# EAGLE board snc98_Display_15x7-Seg_1-digit_SC52 (EAGLE 6.6.0)
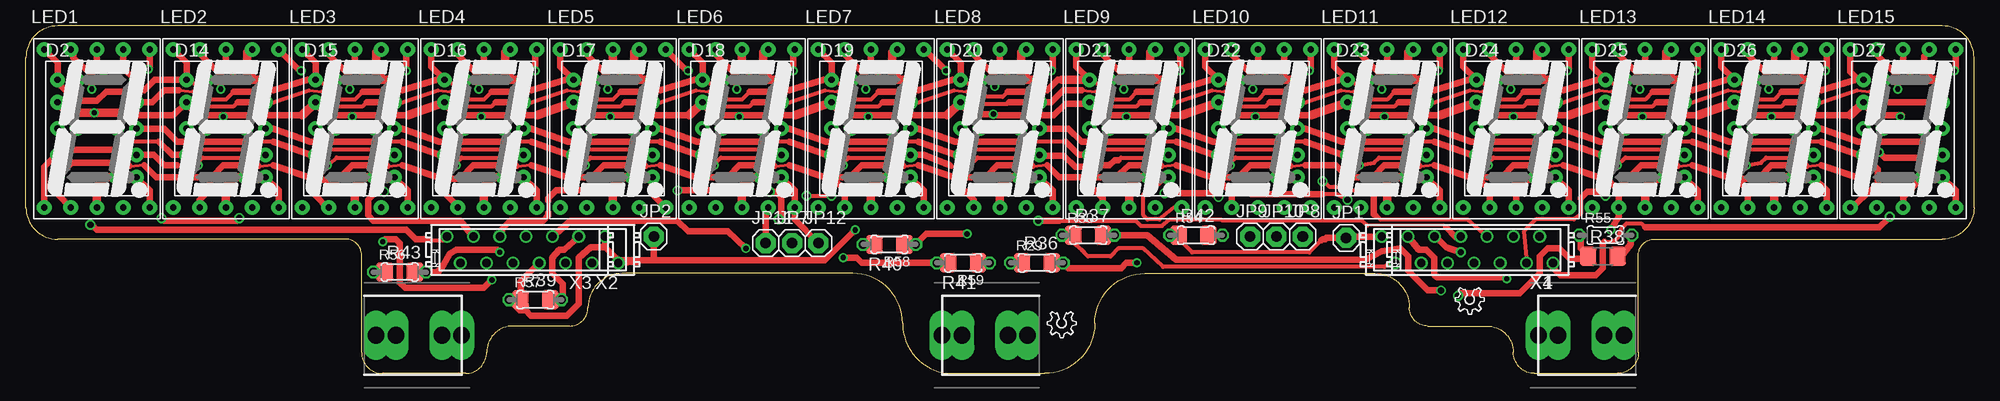
[diagram p3: board, top side]
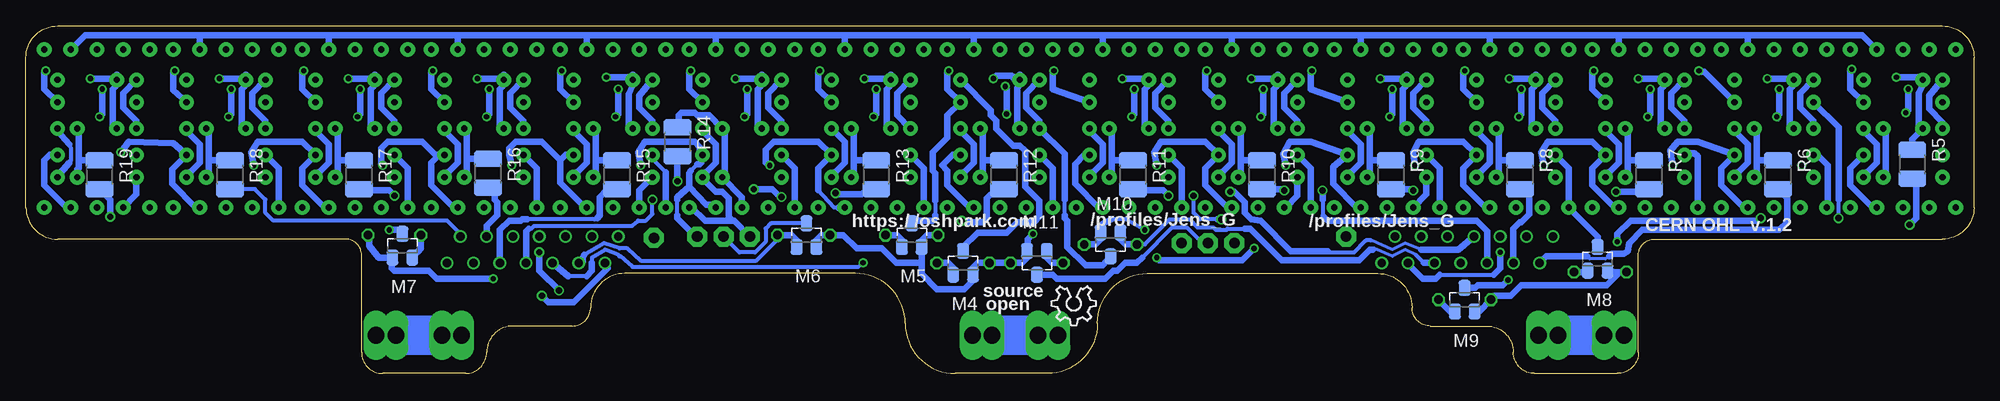
[diagram p4: board, bottom side, seen from below]

Size 187.96 x 33.53 mm. Coordinates in mm from the lower left corner, seen from the top.
Outline: 187.96,30.48 arc90 184.91,33.53 3.05,33.53 arc90 0,30.48 0,16 arc90 3.05,12.95 30.86,12.95 arc-90 32.38,11.43 32.38,2.03 arc90 34.42,0 42.42,0 arc90 44.45,2.03 arc-90 46.99,4.57 52.45,4.57 arc90 54.23,6.35 arc-90 57.53,9.65 79.76,9.65 arc-90 84.58,4.83 arc90 89.41,0 98.3,0 arc90 103.12,4.83 arc-90 107.95,9.65 130.18,9.65 arc-90 133.48,6.35 arc90 135.25,4.57 140.97,4.57 arc-90 143.51,2.03 arc90 145.54,0 153.54,0 arc90 155.57,2.03 155.57,11.43 arc-90 157.1,12.95 184.91,12.95 arc90 187.96,16 187.96,30.48
Copper layers (1*16): Top 0.0356mm / dielectric 1.5011mm / Bottom 0.0356mm
Design rules "OSHPark-2layer *": minimum track width 12mil, minimum drill 13mil, track to track 6mil, track to pad 6mil, pad to pad 6mil, via to via 6mil, smd to smd 6mil, copper to edge 15mil, drill to drill 6mil, minimum pad ring 7mil, minimum via ring 7mil, stop-mask expansion 2.5mil, vias tented up to drill 0mil, thermal gap 10mil

## Footprints (pad centres in the part's own frame; a part is rotated, then mirrored left to right if it is on the bottom)
BATTERY-AAA-LEFT = drill 1.6 long: P1 -2.413,0; P2 3.937,0; P3 2.032,0; P4 -4.318,0
BATTERY-AAA-RIGHT = drill 1.6 long: M1 -3.937,0; M2 2.413,0; M3 4.318,0; M4 -2.032,0
10MM_UNI = drill 0.6 pad 1.422: 1 -3.81,4.699; 2 -3.81,2.54; 3 -3.81,0; 4 -3.81,-2.54; 5 -3.81,-4.699; 6 3.81,-4.699; 7 3.81,-2.54; 8 3.81,0; 9 3.81,2.54; 10 3.81,4.699; 11 -1.905,4.699; 12 -1.905,0; 13 1.905,0; 14 1.905,-4.699
1X01 = drill 1.016 pad 1.93 octagon: 1 0,0
SA52-11 = drill 0.6 pad 1.422: 1 -5.08,-7.62; 2 -2.54,-7.62; 3 0,-7.62; 4 2.54,-7.62; 5 5.08,-7.62; 6 5.08,7.62; 7 2.54,7.62; 8 0,7.62; 9 -2.54,7.62; 10 -5.08,7.62
SOT-23 = smd 1.143 x 1.524: 1 0.953,1.143; 2 -0.953,1.143; 3 0,-1.143
R1210 = smd 1.6 x 2.7: 1 -1.4,0; 2 1.4,0
0204/5 = drill 0.813 octagon: 1 -2.54,0; 2 2.54,0
R1206 = smd 1.6 x 1.803: 1 -1.422,0; 2 1.422,0
MICROMATCH-12 = drill 0.813: 1 6.985,-1.27; 2 5.715,1.27; 3 4.445,-1.27; 4 3.175,1.27; 5 1.905,-1.27; 6 0.635,1.27; 7 -0.635,-1.27; 8 -1.905,1.27; 9 -3.175,-1.27; 10 -4.445,1.27; 11 -5.715,-1.27; 12 -6.985,1.27
MICROMATCH-14 = drill 0.813: 1 8.255,-1.27; 2 6.985,1.27; 3 5.715,-1.27; 4 4.445,1.27; 5 3.175,-1.27; 6 1.905,1.27; 7 0.635,-1.27; 8 -0.635,1.27; 9 -1.905,-1.27; 10 -3.175,1.27; 11 -4.445,-1.27; 12 -5.715,1.27; 13 -6.985,-1.27; 14 -8.255,1.27

## Placement (x,y rotation side)
BH4  HOLDER_AAA_LEFT1  [BATTERY-AAA-LEFT]  150.24,3.68 0 top
BH5  HOLDER_AAA_LEFT1  [BATTERY-AAA-LEFT]  92.71,3.68 0 top
BH6  HOLDER_AAA_RIGHT  [BATTERY-AAA-RIGHT]  37.72,3.68 0 top
D2  SC40-11_UNISC40-11_UNI  [10MM_UNI]  6.86,23.62 0 top
D14  SC40-11_UNISC40-11_UNI  [10MM_UNI]  19.3,23.62 0 top
D15  SC40-11_UNISC40-11_UNI  [10MM_UNI]  31.75,23.62 0 top
D16  SC40-11_UNISC40-11_UNI  [10MM_UNI]  44.2,23.62 0 top
D17  SC40-11_UNISC40-11_UNI  [10MM_UNI]  56.64,23.62 0 top
D18  SC40-11_UNISC40-11_UNI  [10MM_UNI]  69.09,23.62 0 top
D19  SC40-11_UNISC40-11_UNI  [10MM_UNI]  81.53,23.62 0 top
D20  SC40-11_UNISC40-11_UNI  [10MM_UNI]  93.98,23.62 0 top
D21  SC40-11_UNISC40-11_UNI  [10MM_UNI]  106.43,23.62 0 top
D22  SC40-11_UNISC40-11_UNI  [10MM_UNI]  118.87,23.62 0 top
D23  SC40-11_UNISC40-11_UNI  [10MM_UNI]  131.32,23.62 0 top
D24  SC40-11_UNISC40-11_UNI  [10MM_UNI]  143.76,23.62 0 top
D25  SC40-11_UNISC40-11_UNI  [10MM_UNI]  156.21,23.62 0 top
D26  SC40-11_UNISC40-11_UNI  [10MM_UNI]  168.66,23.62 0 top
D27  SC40-11_UNISC40-11_UNI  [10MM_UNI]  181.1,23.62 0 top
JP1  [1X01]  127.38,13.08 0 top
JP2  [1X01]  60.58,13.21 0 top
JP7  [1X01]  73.91,12.57 0 top
JP8  [1X01]  123.19,13.21 0 top
JP9  [1X01]  118.11,13.21 0 top
JP10  [1X01]  120.65,13.21 0 top
JP11  [1X01]  71.37,12.57 0 top
JP12  [1X01]  76.45,12.57 0 top
LED1  7-SEG_SC52-11  [SA52-11]  6.86,23.62 0 top
LED2  7-SEG_SC52-11  [SA52-11]  19.3,23.62 0 top
LED3  7-SEG_SC52-11  [SA52-11]  31.75,23.62 0 top
LED4  7-SEG_SC52-11  [SA52-11]  44.2,23.62 0 top
LED5  7-SEG_SC52-11  [SA52-11]  56.64,23.62 0 top
LED6  7-SEG_SC52-11  [SA52-11]  69.09,23.62 0 top
LED7  7-SEG_SC52-11  [SA52-11]  81.53,23.62 0 top
LED8  7-SEG_SC52-11  [SA52-11]  93.98,23.62 0 top
LED9  7-SEG_SC52-11  [SA52-11]  106.43,23.62 0 top
LED10  7-SEG_SC52-11  [SA52-11]  118.87,23.62 0 top
LED11  7-SEG_SC52-11  [SA52-11]  131.32,23.62 0 top
LED12  7-SEG_SC52-11  [SA52-11]  143.76,23.62 0 top
LED13  7-SEG_SC52-11  [SA52-11]  156.21,23.62 0 top
LED14  7-SEG_SC52-11  [SA52-11]  168.66,23.62 0 top
LED15  7-SEG_SC52-11  [SA52-11]  181.1,23.62 0 top
LOGO1  OSHW_LOGO_8MILX0150-NT  [OSHW_8X150_NOTEXT]  84.73,8.43 180 bottom
LOGO2  OSHW_LOGO_6MILX0100-NT  [OSHW_6X100_NOTEXT]  101.35,5.97 180 top
LOGO3  OSHW_LOGO_6MILX0100-NT  [OSHW_6X100_NOTEXT]  140.72,8.26 180 top
M4  IRLML2244  [SOT-23]  97.54,10.67 180 bottom
M5  IRLML2244  [SOT-23]  102.49,13.34 180 bottom
M6  IRLML2244  [SOT-23]  112.65,13.34 180 bottom
M7  IRLML2244  [SOT-23]  151.64,12.32 180 bottom
M8  IRLML2244  [SOT-23]  36.32,11.05 180 bottom
M9  IRLML2244  [SOT-23]  49.15,7.11 180 bottom
M10  IRLML2244  [SOT-23]  83.31,12.45 0 bottom
M11  IRLML2244  [SOT-23]  90.42,10.67 0 bottom
R5  22  [R1210]  5.97,20.19 270 bottom
R6  22  [R1210]  18.92,19.18 270 bottom
R7  22  [R1210]  31.37,19.18 270 bottom
R8  22  [R1210]  43.81,19.18 270 bottom
R9  22  [R1210]  56.26,19.18 270 bottom
R10  22  [R1210]  68.71,19.18 270 bottom
R11  22  [R1210]  81.15,19.18 270 bottom
R12  22  [R1210]  93.6,19.18 270 bottom
R13  22  [R1210]  105.92,19.18 270 bottom
R14  22  [R1210]  125.09,22.35 270 bottom
R15  22  [R1210]  130.94,19.18 270 bottom
R16  22  [R1210]  143.38,19.3 270 bottom
R17  22  [R1210]  155.83,19.18 270 bottom
R18  22  [R1210]  168.28,19.18 270 bottom
R19  22  [R1210]  180.85,19.18 270 bottom
R29  3k3  [0204/5]  97.54,10.67 0 top
R30  3k3  [0204/5]  102.49,13.34 0 top
R36  3k3  [R1206]  97.54,10.67 0 top
R37  3k3  [R1206]  102.49,13.34 0 top
R38  3k3  [R1206]  152.15,11.3 0 top
R39  3k3  [R1206]  49.15,7.11 0 top
R40  3k3  [R1206]  83.31,12.45 180 top
R41  3k3  [R1206]  90.42,10.67 180 top
R42  3k3  [R1206]  112.65,13.34 0 top
R43  3k3  [R1206]  36.07,9.78 0 top
R54  3k3  [0204/5]  112.9,13.34 0 top
R55  3k3  [0204/5]  152.4,13.34 0 top
R56  3k3  [0204/5]  36.07,9.78 0 top
R57  3k3  [0204/5]  49.15,7.11 0 top
R58  3k3  [0204/5]  83.31,12.45 180 top
R59  3k3  [0204/5]  90.42,10.67 180 top
X1  MICROMATCH-12  [MICROMATCH-12]  140.34,11.94 180 top
X2  MICROMATCH-14  [MICROMATCH-14]  48.9,11.94 180 top
X3  MICROMATCH-12  [MICROMATCH-12]  47.62,11.94 180 top
X4  MICROMATCH-14  [MICROMATCH-14]  139.06,11.94 180 top

## Tracks (layer width: path | path; a pad name or v marks a point on that pad's centre or on a via)
CA_LED  (via drill 0.51, 0.6)
  Top 0.406: 52.7,6.22 52.7,6.1 | 124.97,12.83 123.83,11.68 112.51,11.68 111.4,12.79 | 102.11,11.68 101.9,11.87 | 101.9,11.87 101.09,12.57 101.09,13.31 R37.1 | X4.2 131.57,10.67 131.06,10.29 109.73,10.29 107.82,12.06 105.41,12.06 104.65,11.3 102.46,11.3 101.9,11.87
  Top 0.61: R43.1 R56.1 | 60.33,10.92 77.09,10.92 v80.01,13.84 | 60.33,10.92 59.18,10.92 | 59.18,10.92 57.15,10.92 55.88,12.19 | R36.1 R29.1 | R37.1 101.07,13.36 100.97,13.46 100.08,13.46 R30.1 | R54.1 110.85,13.31 R42.1 111.4,13.17 111.4,12.79 | 55.88,12.19 54.48,12.19 53.34,11.18 53.34,6.73 52.7,6.1 52.2,5.59 48.72,5.59 48.21,6.1 47.62,6.1 R57.1 R39.1 | X4.1 126.75,13.21 JP1.1 125.48,13.08 125.35,12.95 125.09,12.95 124.97,12.83 | X2.13 55.88,12.19 | X2.14 59.05,10.79 59.18,10.92 | JP2.1 60.58,11.18 60.33,10.92 | R58.1 R40.1 | R58.1 85.27,12.45 | 47.75,7.09 R39.1 | 47.62,7.21 R39.1 | R41.1 R59.1 | v90.81,13.46 86.87,13.46 R58.1 | R55.1 149.99,13.21 149.99,12.06 150.72,11.33 R38.1 150.5,11.07 148.95,11.07 147.96,12.06 146.81,12.06 146.05,11.3 146.05,9.65 144.15,7.75 138.43,7.75 v138.18,7.49 | X2.8 47.75,8.89 47.75,7.09 | 47.75,7.09 48.21,6.63
  Bottom 0.406: v80.01,13.84 81.79,14.86 83.19,14.86
  Bottom 0.61: R56.1 35.26,9.78 M8.2 34.24,9.7 35.43,8.51 43.69,8.51 44.7,7.49 46.23,7.49 R57.1 47.75,5.97 M9.2 | R30.1 R37.1 101.55,12.85 M5.2 101.55,12.31 101.55,10.67 | 84.84,12.45 R58.1 R40.1 84.25,12.93 M10.2 84.25,13.92 84.25,14.17 83.95,14.48 83.19,14.86 | v90.81,13.46 91.31,12.95 91.31,11.73 M11.2 91.36,11.15 R41.1 R59.1 R29.1 R36.1 96.6,10.19 M4.2 96.65,9.6 96.65,8.89 97.41,8.13 100.08,8.13 101.55,9.6 101.55,10.67 | X4.2 131.83,10.16 135.13,6.86 137.54,6.86 v138.18,7.49 | M7.2 R38.1 150.72,11.33 150.11,11.81 | 150.11,11.81 149.86,12.06 R55.1 | 150.11,11.81 150.62,11.3 150.75,11.3 | M6.2 111.7,12.87 R42.1 R54.1 109.09,13.34 107.82,12.06 105.41,12.06 104.01,10.67 101.55,10.67
D0_A  (via drill 0.6)
  Top 0.406: 38.61,12.95 38.73,12.95 38.86,12.83 40.39,12.83 40.51,12.95
  Top 0.61: 38.61,12.95 37.59,12.95 36.7,13.84 6.86,13.84 6.35,14.35 v6.22,14.35 | X2.1 40.77,13.21 40.51,12.95
  Bottom 0.61: R5.2 5.59,18.41 5.59,14.99 v6.22,14.35
D1_A
  Bottom 0.305: 35.31,11.3 35.56,11.05 37.08,11.05 37.34,11.3
  Bottom 0.406: 35.18,11.3 35.31,11.3
  Bottom 0.61: R6.2 18.03,16.89 18.03,14.61 18.8,13.84 32,13.84 33.27,12.57 33.4,11.81 33.78,11.56 34.92,11.56 35.18,11.3 | 37.34,11.3 41.27,11.3 X2.2
D2_A  (via drill 0.6)
  Top 0.61: X2.3 41.91,14.73 33.53,14.73 33.02,15.24 33.02,16.76 33.66,17.4 34.16,17.4 v34.54,17.53
  Bottom 0.61: v34.54,17.53 31.62,17.53 R7.2
D3_A
  Bottom 0.61: R8.2 43.69,17.78 42.93,17.02 42.93,15.37 43.69,14.61 43.81,14.61 44.45,13.97 X2.4
D4_A  (via drill 0.6)
  Top 0.406: 50.42,16.64 50.42,15.49
  Top 0.61: v54.1,17.65 51.18,17.65 50.42,16.89 50.42,16.64 | 50.42,15.49 50.42,15.24 49.91,14.73 46.74,14.73 45.97,13.97 X2.5
  Bottom 0.61: R9.2 54.23,17.78 v54.1,17.65
D5_A  (via drill 0.6)
  Top 0.61: v66.55,17.65 v62.87,17.65
  Bottom 0.406: 62.87,16.76 62.87,15.24 62.74,15.11
  Bottom 0.61: X2.6 46.99,13.72 48.01,14.73 62.36,14.73 62.74,15.11 | R10.2 66.67,17.78 v66.55,17.65 | v62.87,17.65 62.87,16.76
D6_A  (via drill 0.6)
  Top 0.406: v75.31,17.14 v77.72,17.14
  Top 0.61: v71.75,17.53 72.39,17.53 72.9,17.02 72.9,14.99 v72.64,14.86
  Bottom 0.305: 53.34,11.94 54.86,12.57 56.13,11.94 58.17,12.83
  Bottom 0.406: 58.17,12.83 58.67,12.83 59.82,11.68 62.23,11.68 62.36,11.81 | v77.72,17.14 77.85,17.27 | 73.03,14.86 74.68,14.86 75.31,15.49 v75.31,17.14
  Bottom 0.61: 53.34,11.94 49.78,11.94 X2.7 | 62.36,11.81 65.91,11.81 68.83,14.73 69.72,14.86 70.36,15.49 70.36,16.51 71.37,17.53 v71.75,17.53 | 77.85,17.27 78.23,17.65 81.03,17.65 R11.2 | v72.64,14.86 73.03,14.86
D7_A  (via drill 0.6)
  Top 0.305: 137.03,13.97 136.78,14.28 129.41,14.28
  Top 0.406: 99.69,14.73 107.06,14.73 107.57,14.22 109.6,14.22 110.36,14.86 115.32,14.86 115.44,14.73 128.91,14.73 129.41,14.28 | 137.03,14.1 137.03,13.97
  Top 0.61: v97.66,14.73 99.69,14.73 | X4.7 137.92,13.21 137.03,14.1
  Bottom 0.61: R12.2 94.36,17.78 95.25,16.89 95.25,14.99 95.63,14.61 97.54,14.61 v97.66,14.73
D8_A  (via drill 0.6)
  Top 0.406: v127.51,16.76 126.49,17.27 125.09,17.27
  Top 0.61: v109.86,17.4 114.43,17.4 v115.06,17.02 | 125.09,17.27 118.24,17.27 v117.73,17.78
  Bottom 0.406: v127.51,16.76 127.51,15.37 128.14,14.73 128.91,14.73 129.41,14.28 129.46,14.22 138.94,14.22 139.19,13.97 139.45,13.97
  Bottom 0.61: X4.8 139.7,13.72 139.45,13.97 | R13.2 106.81,17.78 107.31,17.27 109.6,17.27 v109.86,17.4 | v115.06,17.02 115.06,16.89 115.95,17.78 v117.73,17.78
D9_A  (via drill 0.6)
  Top 0.406: 130.18,15.24 130.3,15.24 130.68,14.86 139.06,14.86 X4.9 | v125.09,18.54 125.22,18.54 125.73,18.03 126.36,18.03 128.02,17.65 129.54,17.65 129.67,17.53
  Top 0.61: 129.67,17.53 130.05,17.14 130.05,15.37 130.18,15.24
  Bottom 0.61: R14.2 v125.09,18.54
D10_A
  Bottom 0.406: 132.84,14.99 132.97,14.99 133.1,14.86 139.57,14.86
  Bottom 0.61: 132.84,14.99 132.59,15.24 132.59,17.02 131.95,17.65 131.06,17.65 R15.2 | 139.57,14.86 140.08,14.86 140.21,14.73 141.35,14.73 142.24,13.84 X4.10
D11_A
  Bottom 0.61: R16.2 142.87,17.9 142.75,17.78 142.75,16.76 142.49,16.51 142.49,15.24 143.51,14.22 X4.11
D12_A  (via drill 0.6)
  Top 0.406: 149.99,16.89 149.99,15.37 149.35,14.86 145.67,14.86 144.53,13.72 X4.12
  Top 0.61: v152.4,17.14 152.27,17.14 151.89,17.53 150.62,17.53 149.99,16.89
  Bottom 0.61: v152.4,17.14 152.91,17.65 155.83,17.65 R17.2
D13_A
  Bottom 0.406: X4.13 146.05,13.46 147.32,14.73 164.08,14.73 164.85,15.49 164.85,16.76 165.86,17.78 R18.2
D14_A  (via drill 0.6)
  Top 0.406: 152.27,12.7 153.16,12.7 153.67,13.21 153.92,13.97 154.43,14.48 155.83,14.48 156.21,14.1
  Top 0.61: 152.27,12.7 152.15,12.57 152.15,10.16 151.45,9.46 148.02,9.46 147.07,10.41 X4.14 | 156.21,14.1 178.82,14.1 179.71,14.99 179.71,15.11 v179.83,15.11
  Bottom 0.61: v179.83,15.11 179.83,16.76 R19.2
DIG_0  (via drill 0.51)
  Top 0.61: LED1.8 6.86,29.84 7.49,29.21 v7.49,28.57 | LED1.3 6.86,16.12
  Top 0.813: D2.14 7.75,18.92 6.86,18.03 6.86,16.12 | D2.13 D2.12
  Bottom 0.61: D2.11 4.95,27.81 5.33,27.05 5.33,24 D2.12 5.97,22.61 R5.1 | v7.49,28.57 5.21,28.57 4.95,28.45 | 8.76,23.5 8.51,23.24 8.51,19.18 D2.14
  Bottom 0.813: D2.11 4.95,28.45 | D2.13 8.76,23.5
DIG_1  (via drill 0.51)
  Top 0.61: v19.94,28.45 19.94,29.21 19.3,29.84 LED2.8 | LED2.3 19.3,16.12
  Top 0.813: 19.3,16.12 19.3,18.03 20.19,18.92 D14.14 | D14.13 D14.12
  Bottom 0.61: D14.12 17.78,24 17.78,27.43 17.4,27.81 D14.11 17.53,28.45 v19.94,28.45 | 21.21,23.5 20.95,23.24 20.95,20.45 | 20.95,20.45 20.95,19.18 D14.14 | R6.1 20.82,20.58 20.95,20.45
  Bottom 0.813: D14.13 21.21,23.5
DIG_2  (via drill 0.51)
  Top 0.61: v32.38,28.45 32.38,29.21 31.75,29.84 LED3.8 | LED3.3 31.75,16.12
  Top 0.813: D15.13 D15.12 | 31.75,16.12 31.75,18.03 32.64,18.92 D15.14
  Bottom 0.61: D15.12 30.23,24 30.23,27.43 29.84,27.81 D15.11 29.97,28.45 v32.38,28.45 | 33.66,23.5 33.4,23.24 33.4,20.45 | 33.4,20.45 33.4,19.18 D15.14 | R7.1 33.27,20.58 33.4,20.45
  Bottom 0.813: D15.13 33.66,23.5
DIG_3  (via drill 0.51)
  Top 0.61: v44.83,28.45 44.83,29.21 44.2,29.84 LED4.8 | LED4.3 44.2,16.12
  Top 0.813: D16.13 D16.12 | 44.2,16.12 44.2,18.03 45.09,18.92 D16.14
  Bottom 0.61: 46.1,23.5 45.85,23.24 45.85,20.57 | D16.11 42.29,27.81 42.67,27.43 42.67,24 D16.12 | 42.29,28.7 42.55,28.45 v44.83,28.45 | 45.85,20.57 45.85,19.18 D16.14 | R8.1 45.84,20.58 45.85,20.57
  Bottom 0.813: D16.13 46.1,23.5 | D16.11 42.29,28.7
DIG_4  (via drill 0.51)
  Top 0.61: 56.64,29.84 57.28,29.21 v57.28,28.45 | 56.64,31.12 LED5.8 | LED5.3 56.64,16.12
  Top 0.813: 56.64,16.12 56.64,18.03 57.53,18.92 D17.14 | D17.13 D17.12 | 56.64,29.84 56.64,31.12
  Bottom 0.61: D17.11 54.74,27.81 55.12,27.43 55.12,24 D17.12 | 54.74,28.7 54.99,28.45 v57.28,28.45 | 58.55,23.5 58.29,23.24 58.29,20.57 | 58.29,20.57 58.29,19.18 D17.14 | R9.1 58.29,20.58 58.29,20.57
  Bottom 0.813: D17.11 54.74,28.7 | D17.13 58.55,23.5
DIG_5  (via drill 0.51)
  Top 0.61: 69.09,29.84 69.72,29.21 v69.72,28.45 | 69.09,31.12 LED6.8 | LED6.3 69.09,16.12
  Top 0.813: D18.12 D18.13 | 69.09,16.12 69.09,18.03 69.98,18.92 D18.14 | 69.09,31.12 69.09,29.84
  Bottom 0.61: 70.99,23.5 70.74,23.24 70.74,20.45 | 70.74,20.45 70.74,19.18 D18.14 | D18.11 67.18,27.81 67.56,27.43 67.56,24 D18.12 | 67.18,28.7 67.44,28.45 v69.72,28.45 | R10.1 70.61,20.58 70.74,20.45
  Bottom 0.813: D18.13 70.99,23.5 | D18.11 67.18,28.7
DIG_6  (via drill 0.51)
  Top 0.61: v82.17,28.45 82.17,29.21 81.53,29.84 LED7.8 | LED7.3 81.53,16.12
  Top 0.813: D19.13 D19.12 | 81.53,16.12 81.53,18.03 82.42,18.92 D19.14
  Bottom 0.61: D19.12 80.01,24 80.01,27.43 79.63,27.81 D19.11 79.76,28.45 79.88,28.45 | v82.17,28.45 79.88,28.45 | 79.88,28.45 79.63,28.7 | 83.44,23.5 83.19,23.24 83.19,20.57 | 83.19,20.57 83.19,19.18 D19.14 | R11.1 83.18,20.58 83.19,20.57
  Bottom 0.813: D19.13 83.44,23.5
DIG_7  (via drill 0.51)
  Top 0.305: LED8.3 93.98,16.12
  Top 0.61: v94.61,28.45 94.61,29.21 93.98,29.84 LED8.8
  Top 0.813: D20.13 D20.12 | 93.98,16.12 93.98,18.03 94.87,18.92 D20.14
  Bottom 0.61: D20.11 92.08,27.81 92.33,27.56 92.33,23.88 D20.12 | 92.08,28.7 92.33,28.45 92.58,28.45 92.84,28.7 94.36,28.7 v94.61,28.45 | 95.89,23.5 95.63,23.24 95.63,20.7 | 95.63,20.7 95.63,19.18 D20.14 | R12.1 95.51,20.58 95.63,20.7
  Bottom 0.813: D20.11 92.08,28.7 | D20.13 95.89,23.5
DIG_8  (via drill 0.51)
  Top 0.61: v107.06,28.45 107.06,29.21 106.43,29.84 LED9.8 | LED9.3 106.43,16.12
  Top 0.813: D21.13 D21.12 | 106.43,16.12 106.43,18.03 107.31,18.92 D21.14
  Bottom 0.61: D21.11 104.52,27.81 104.9,27.43 104.9,24 D21.12 | v107.06,28.45 104.78,28.45 104.52,28.7 | 108.33,23.5 108.08,23.24 108.08,20.57 | 108.08,20.57 108.08,19.18 D21.14 | R13.1 108.07,20.58 108.08,20.57
  Bottom 0.813: D21.11 104.52,28.7 | D21.13 108.33,23.5
DIG_9  (via drill 0.51)
  Top 0.61: v119.51,28.45 119.51,29.21 118.87,29.84 LED10.8
  Top 0.813: D22.13 D22.12
  Bottom 0.406: 124.97,24.38 124.97,24.13 R14.1
  Bottom 0.61: D22.11 116.97,27.81 117.35,27.43 117.35,24 D22.12 | v119.51,28.45 117.22,28.45 116.97,28.7 | 120.78,23.5 120.52,23.24 120.52,20.57 | 120.52,20.57 120.52,19.18 D22.14 118.87,17.02 LED10.3 | 120.52,20.58 120.52,20.57 | D22.13 122.05,24.89 123.19,24.89 123.44,25.15 124.71,25.15 124.97,24.89 124.97,24.38
  Bottom 0.813: D22.11 116.97,28.7 | D22.13 120.78,23.5
DIG_10  (via drill 0.51)
  Top 0.61: v131.95,28.57 131.95,29.21 131.32,29.84 LED11.8 | LED11.3 131.32,16.12
  Top 0.813: D23.13 D23.12 | 131.32,16.12 131.32,18.54 131.7,18.92 D23.14 132.21,18.92
  Bottom 0.61: 133.22,23.5 132.97,23.24 132.97,20.45 | 132.97,20.45 132.97,19.18 D23.14 | D23.11 129.41,27.81 129.79,26.92 129.79,24 D23.12 | v131.95,28.57 129.67,28.57 129.41,28.7 | R15.1 132.84,20.58 132.97,20.45
  Bottom 0.813: D23.13 133.22,23.5 | D23.11 129.41,28.7
DIG_11  (via drill 0.51)
  Top 0.61: v144.4,28.45 144.4,29.21 143.76,29.84 LED12.8 | LED12.3 143.76,18.29
  Top 0.813: D24.13 D24.12 | 143.76,18.29 144.27,18.8 145.54,18.8 D24.14
  Bottom 0.61: D24.11 141.86,27.81 142.24,27.43 142.24,24 D24.12 | 141.86,28.7 142.11,28.45 v144.4,28.45 | 145.67,23.5 145.41,23.24 145.41,20.83 | 145.41,20.83 145.41,19.18 D24.14 | R16.1 145.29,20.7 145.41,20.83
  Bottom 0.813: D24.11 141.86,28.7 | D24.13 145.67,23.5
DIG_12  (via drill 0.51)
  Top 0.61: v156.84,28.45 156.84,29.21 156.21,29.84 LED13.8 | 156.21,16.12 LED13.3
  Top 0.813: D25.13 D25.12 | 156.21,16.12 156.21,18.03 156.97,18.8 157.99,18.8 D25.14
  Bottom 0.61: 158.12,23.5 157.86,23.24 157.86,20.7 | 157.86,20.7 157.86,19.18 D25.14 | D25.11 154.31,27.81 154.69,27.43 154.69,24 D25.12 | v156.84,28.45 154.56,28.45 154.31,28.7 | R17.1 157.74,20.58 157.86,20.7
  Bottom 0.813: D25.13 158.12,23.5 | D25.11 154.31,28.7
DIG_13  (via drill 0.51)
  Top 0.61: LED14.8 168.66,29.84 169.29,29.21 v169.29,28.45 | LED14.3 168.66,16.12
  Top 0.813: D26.13 D26.12 | D26.14 169.04,18.92 168.66,18.54 168.66,16.12
  Bottom 0.61: D26.11 166.75,27.81 167.13,27.43 167.13,24 D26.12 | v169.29,28.45 167,28.45 166.75,28.7 | 170.56,23.5 170.31,23.24 170.31,20.57 | 170.31,20.57 170.31,19.18 D26.14 | R18.1 170.3,20.58 170.31,20.57
  Bottom 0.813: D26.11 166.75,28.7 | D26.13 170.56,23.5
DIG_14  (via drill 0.51)
  Top 0.61: v181.74,28.45 181.74,29.21 181.1,29.84 LED15.8 | LED15.3 181.1,17.02 D27.14
  Top 0.813: D27.13 D27.12 | D27.14 182.88,18.92
  Bottom 0.61: D27.11 179.2,27.81 179.58,27.43 179.58,24 D27.12 | v181.74,28.45 179.45,28.45 179.2,28.7 | D27.14 183.01,19.68 182.88,19.81 182.88,20.7 | 182.88,20.7 182.88,23.5 | R19.1 182.76,20.58 182.88,20.7
  Bottom 0.813: D27.11 179.2,28.7 | D27.13 182.88,23.5
IO-A  (via drill 0.51)
  Top 0.61: R36.2 R29.2 100.58,10.16 105.66,10.16 106.17,10.67 v107.19,10.67
  Bottom 0.406: 133.86,9.4 135.64,9.4 | 133.35,10.67 133.35,11.18 132.08,11.94 130.81,11.43 130.68,11.3 130.56,11.3 129.41,10.29 107.7,10.29 v107.19,10.67
  Bottom 0.61: M4.1 98.48,10.19 R36.2 R29.2 | 135.64,9.4 X4.6 | 133.35,10.67 133.35,9.91 133.86,9.4
IO-B  (via drill 0.6)
  Top 0.61: R37.2 R30.2 108.2,13.34 111,10.97 129.29,10.97 130.81,11.81 132.59,12.06 133.35,11.3 133.35,9.91 135.25,8 v136.53,8 | X4.5 136.02,13.21 137.03,12.19 137.29,12.06 v138.43,11.68
  Bottom 0.61: M5.1 103.43,12.85 R37.2 R30.2 | v138.43,11.68 138.43,9.91 v136.53,8
IO-C
  Top 0.61: R42.2 114.71,13.31 R54.2
  Bottom 0.406: 115.44,12.95 117.47,10.87 128.65,10.87 129.92,12.06 130.68,12.06 132.21,12.57 134.11,11.43
  Bottom 0.61: M6.1 113.6,12.87 R42.2 R54.2 115.44,12.95 | 134.11,11.43 134.24,11.18 134.24,10.79 X4.4
IO-D  (via drill 0.51 pad 0.25)
  Top 0.61: X4.3 134.37,11.94 135.13,11.94 135.89,11.18 135.89,9.53 136.14,9.27 142.75,9.27 v142.88,9.14 | R38.2 153.92,11.3 154.81,12.45 154.81,13.21 R55.2
  Bottom 0.61: R55.2 154.81,13.21 154.81,12.32 153.92,11.18 M7.1 152.71,11.3 152.65,11.1 152.65,10.16 152.4,9.91 149.1,9.91 148.34,9.14 v142.88,9.14
IO-DP  (via drill 0.51, 0.51 pad 0.25)
  Top 0.61: R41.2 R59.2 80.64,10.67 80.14,11.18 v78.87,11.18 | v69.47,12.06 67.69,13.72 63.88,13.72 62.87,14.73 52.58,14.73 X2.9
  Bottom 0.61: 88.34,10.67 R59.2 R41.2 89.47,11.14 M11.1 | v78.87,11.18 78.61,10.92 70.61,10.92 v69.47,12.06
IO-E  (via drill 0.51)
  Top 0.61: R43.2 R56.2 39.75,9.78 40.26,10.41 40.89,11.56 41.53,11.94 45.47,11.94 v45.72,11.68
  Bottom 0.406: 51.56,9.53 46.35,9.53
  Bottom 0.61: R56.2 37.39,9.78 M8.1 | v45.72,11.68 45.72,10.16 46.35,9.53 | 51.56,9.53 51.94,9.14 53.21,9.14 54.74,10.67 X2.12
IO-F
  Top 0.61: R39.2 R57.2 51.82,7.24 51.82,8.64 50.8,9.65 50.8,11.18 51.44,11.94 51.94,11.94 X2.11
  Bottom 0.61: M9.1 50.55,5.97 R57.2
IO-G
  Top 0.61: R40.2 R58.2
  Bottom 0.305: 53.85,11.43 54.86,11.94 56.13,11.3 57.91,12.06
  Bottom 0.406: R58.2 80.01,12.45 77.6,14.86 75.69,14.86 74.93,14.1 73.41,14.1 73.15,13.84 72.14,13.84 72.01,13.97 70.36,13.97 | 53.09,10.67 53.85,11.43 | 57.91,12.06 58.04,11.94
  Bottom 0.61: M10.1 82.37,12.93 R40.2 R58.2 | X2.10 53.09,10.67 | 58.04,11.94 58.29,11.94 59.31,10.92 66.8,10.92 69.85,13.97 70.36,13.97
NC1
  Bottom 2.184: BH4.P1 BH4.P4 | BH4.P3 BH4.P2
  Bottom 3.81: BH4.P1 BH4.P3
NC2
  Bottom 2.184: BH5.P1 BH5.P4 | BH5.P3 BH5.P2
  Bottom 3.81: BH5.P1 BH5.P3
NC3
  Bottom 2.184: BH6.M1 BH6.M4 | BH6.M2 BH6.M3
  Bottom 3.81: BH6.M4 BH6.M2
SEG_A
  Top 0.61: D2.10 10.54,28.32 9.4,29.46 LED1.7 | 21.34,30.97 21.57,30.97 LED2.7 | 33.78,30.97 34.02,30.97 LED3.7 | 46.23,30.97 46.46,30.97 LED4.7 | 58.67,30.97 58.91,30.97 LED5.7 | 71.12,30.97 71.36,30.97 LED6.7 | 83.57,30.97 83.8,30.97 LED7.7 | 96.01,30.97 96.25,30.97 LED8.7 | 108.46,30.97 108.69,30.97 LED9.7 | LED10.7 121.41,28.83 121.16,28.57 | 133.35,30.97 133.59,30.97 LED11.7 | LED12.7 146.07,31.24 145.8,30.97 | 158.24,30.97 158.48,30.97 LED13.7 | 170.69,30.97 170.92,30.97 LED14.7 | LED15.7 183.64,31.11 183.13,30.61 183.13,29.08
  Top 0.813: 21.34,29.08 22.1,28.32 D14.10 21.84,28.32 21.34,28.83 21.34,30.97 | 183.13,28.83 183.64,28.32 D27.10 183.9,28.32 183.13,29.08 | 58.67,30.97 58.67,28.83 59.18,28.32 D17.10 59.44,28.32 58.67,29.08 | 34.54,28.32 34.29,28.32 33.78,28.83 33.78,30.97 | 34.54,28.32 33.78,29.08 | D15.10 34.54,28.32 | 158.24,29.08 159,28.32 D25.10 158.75,28.32 158.24,28.83 158.24,30.97 | 170.69,29.08 171.45,28.32 D26.10 171.2,28.32 170.69,28.83 170.69,30.97 | 145.8,29.08 146.56,28.32 D24.10 146.3,28.32 145.8,28.83 145.8,30.97 | 121.16,28.57 121.41,28.32 D22.10 121.67,28.32 | 133.35,29.08 134.11,28.32 D23.10 133.86,28.32 133.35,28.83 133.35,30.97 | 96.01,29.08 96.77,28.32 D20.10 96.52,28.32 96.01,28.83 96.01,30.97 | 108.46,29.08 109.22,28.32 D21.10 108.97,28.32 108.46,28.83 108.46,30.97 | 71.12,29.08 71.88,28.32 D18.10 71.63,28.32 71.12,28.83 71.12,30.97 | 83.57,29.08 84.33,28.32 D19.10 84.07,28.32 83.57,28.83 83.57,30.97 | 46.23,29.08 46.99,28.32 D16.10 46.74,28.32 46.23,28.83 46.23,30.97
  Bottom 0.61: 21.84,32.64 10.79,32.64 LED1.7 | 34.04,32.64 21.84,32.64 | 46.74,32.64 34.04,32.64 | 59.18,32.64 46.74,32.64 | 171.2,32.64 158.75,32.64 | 158.75,32.64 146.3,32.64 | 108.97,32.64 96.77,32.64 | 146.3,32.64 133.86,32.64 | 133.86,32.64 121.41,32.64 | 121.41,32.64 108.97,32.64 | 96.77,32.64 84.2,32.64 | 84.2,32.64 71.63,32.64 | 71.63,32.64 59.18,32.64 | M4.3 97.56,11.71 97.56,12.17 96.14,13.59 93.34,13.59 92.33,14.61 90.68,14.61 90.17,15.11 90.17,16.64 91.57,18.03 91.57,21.46 92.08,21.97 92.71,21.97 94.36,23.62 94.36,24.38 94.87,24.89 94.87,25.4 D20.10 | LED2.7 21.84,32.64 | LED3.7 34.29,32.51 34.04,32.64 | LED4.7 46.74,32.64 | LED5.7 59.18,32.64 | LED6.7 71.63,32.64 | LED7.7 84.07,32.51 84.2,32.64 | LED8.7 96.52,32.51 96.77,32.64 | LED9.7 108.97,32.64 | LED10.7 121.41,32.64 | LED11.7 133.86,32.64 | LED12.7 146.3,32.64 | LED13.7 158.75,32.64 | LED14.7 171.2,32.64 | 171.2,32.64 182.25,32.64 LED15.7
SEG_B  (via drill 0.51)
  Top 0.305: 14.86,27.3 16.13,27.18 | 27.3,27.3 28.57,27.18 | 176.66,27.3 177.93,27.18 | 164.21,27.3 165.48,27.18 | 39.75,27.3 41.02,27.18 | 52.2,27.3 53.47,27.18 | 126.87,27.3 128.14,27.18 | 114.43,27.3 115.7,27.18 | 77.09,27.3 78.36,27.18 | 64.64,27.3 65.91,27.18 | 139.32,27.3 140.59,27.18 | 89.53,27.3 90.81,27.18 | 151.76,27.3 153.03,27.18 | 101.85,27.3 103.25,27.18
  Top 0.406: D2.9 11.43,26.16 | 16.13,27.18 17.53,25.78 20.07,25.78 20.45,26.16 | 27.3,27.3 23.88,26.16 D14.9 | 28.57,27.18 29.97,25.78 32.51,25.78 32.89,26.16 | 176.66,27.3 173.23,26.16 D26.9 | 157.35,26.16 156.97,25.78 154.43,25.78 153.03,27.18 | 164.21,27.3 160.78,26.16 D25.9 | 165.48,27.18 166.88,25.78 169.42,25.78 169.8,26.16 | 39.75,27.3 36.32,26.16 D15.9 | 41.02,27.18 42.42,25.78 44.96,25.78 45.34,26.16 | 52.2,27.3 48.77,26.16 D16.9 | 53.47,27.18 54.86,25.78 57.4,25.78 57.78,26.16 | 120.02,26.16 119.63,25.78 117.09,25.78 115.7,27.18 | 126.87,27.3 123.44,26.16 D22.9 | 128.14,27.18 129.54,25.78 132.08,25.78 132.46,26.16 | 114.43,27.3 111,26.16 D21.9 | 70.23,26.16 69.85,25.78 67.31,25.78 65.91,27.18 | 77.09,27.3 73.66,26.16 D18.9 | 78.36,27.18 79.76,25.78 82.3,25.78 82.68,26.16 | 64.64,27.3 61.21,26.16 D17.9 | 139.32,27.3 135.89,26.16 D23.9 | 140.59,27.18 141.99,25.78 144.53,25.78 144.91,26.16 | D24.9 148.34,26.16 151.76,27.3 | 89.53,27.3 86.11,26.16 D19.9 | 90.81,27.18 91.95,26.04 94.74,26.04 94.87,26.16 | 103.25,27.18 104.65,25.78 107.19,25.78 107.57,26.16 | 178.94,26.16 177.93,27.18 | 14.86,27.3 14.73,27.3
  Top 0.61: 20.45,26.16 D14.9 | 32.89,26.16 D15.9 | 157.35,26.16 D25.9 | 169.8,26.16 D26.9 | 45.34,26.16 D16.9 | 120.02,26.16 D22.9 | 123.57,29.21 v123.83,29.21 123.95,29.34 LED10.6 | 132.46,26.16 D23.9 | 70.23,26.16 D18.9 | 82.68,26.16 D19.9 | 57.78,26.16 D17.9 | 144.91,26.16 D24.9 | 94.87,26.16 D20.9 98.93,26.16 100.08,27.3 101.85,27.3 | 107.57,26.16 D21.9 | D27.9 178.94,26.16 | LED1.6 11.94,29.34 v11.81,29.34 | D2.9 12.19,26.16 13.34,27.3 14.73,27.3 | v26.54,29.21 26.42,29.21 LED2.6 | v36.7,29.21 36.7,31.11 LED3.6 | v49.15,29.21 49.15,31.11 LED4.6 | v63.88,29.21 63.75,29.21 LED5.6 | v74.04,29.21 74.04,31.11 LED6.6 | LED7.6 86.74,31.24 v88.77,29.21 | LED8.6 99.06,29.34 v98.93,29.21 | v111.38,29.21 111.38,31.11 LED9.6 | LED11.6 136.4,29.34 v136.27,29.21 | LED12.6 148.84,29.34 v148.72,29.21 | LED13.6 161.29,29.34 v161.16,29.21 | LED14.6 173.74,29.34 v173.61,29.21 | LED15.6 186.18,29.34 v186.06,29.21
  Bottom 0.406: 11.94,27.43 11.94,27.3 | 100.2,16.64 100.2,15.24
  Bottom 0.61: v11.81,29.34 11.94,29.08 11.94,27.43 D2.9 | v26.54,29.21 26.67,29.08 26.04,29.08 D14.9 | v98.93,29.21 99.06,29.08 99.06,27.43 D20.9 99.06,24.89 99.06,22.73 100.46,21.34 100.46,19.56 100.2,19.3 100.2,16.64 | v111.38,29.21 111.51,29.08 111.51,27.43 D21.9 | v173.61,29.21 173.74,28.96 173.74,27.3 D26.9 | D27.9 186.18,27.43 186.18,29.08 v186.06,29.21 | v136.27,29.21 136.4,29.08 136.4,27.43 D23.9 | v161.16,29.21 161.29,29.08 161.29,27.43 D25.9 | v148.72,29.21 148.84,29.08 148.84,27.43 D24.9 | v123.83,29.21 123.95,29.08 123.95,27.43 D22.9 | v88.77,29.21 88.9,29.08 88.9,27.43 D19.9 | v74.04,29.21 74.17,29.08 74.17,27.43 D18.9 | v63.88,29.21 64.01,29.08 64.01,27.43 D17.9 | v49.15,29.21 49.28,29.08 49.28,27.43 D16.9 | v36.7,29.21 36.83,29.08 36.83,27.43 D15.9 | 100.2,15.24 100.2,14.99 100.46,14.73 102.23,14.73 M5.3
SEG_C  (via drill 0.51)
  Top 0.305: 14.61,20.07 16.51,19.94 | 91.06,20.07 89.28,19.94 | 103.38,20.07 101.85,19.94
  Top 0.406: D14.7 22.86,20.83 17.02,20.83 16.51,20.32 v16.64,20.07 16.51,19.94 | v29.08,20.07 29.97,20.83 35.31,20.83 D15.7 | v41.53,20.07 41.53,20.32 42.04,20.83 47.75,20.83 D16.7 | v53.98,20.07 53.98,20.32 54.48,20.83 60.2,20.83 D17.7 | v78.87,20.07 78.87,20.32 79.38,20.83 85.09,20.83 D19.7 | 91.06,20.07 91.82,20.83 97.54,20.83 D20.7 | v66.42,20.07 66.29,20.07 67.06,20.83 72.64,20.83 D18.7 | v141.1,20.07 141.1,20.32 141.6,20.83 147.32,20.83 D24.7 | v153.54,20.07 154.31,20.83 159.77,20.83 D25.7 | v165.99,20.07 167.39,20.32 167.89,20.83 172.21,20.83 D26.7 | v116.2,20.07 116.2,20.32 116.71,20.83 122.43,20.83 D22.7 | v128.65,20.07 130.05,20.32 130.56,20.83 134.87,20.83 D23.7 | D21.7 109.98,20.83 105.66,20.83 105.41,20.57 | 89.28,19.94 89.15,20.07
  Top 0.61: D27.7 184.66,20.83 179.32,20.83 v178.82,21.34 | D2.7 12.32,21.08 13.34,20.07 14.61,20.07 | 71.37,13.08 71.37,15.75 LED6.4 | 89.15,20.07 86.61,21.08 D19.7 | 105.41,20.57 105.03,20.57 104.52,20.07 103.38,20.07 | 101.85,19.94 101.22,19.94 100.14,21.02 97.85,21.02 D20.7
  Top 0.813: JP11.1 71.37,13.08
  Bottom 0.406: 109.6,16 109.98,16 111.51,17.65 | 123.83,19.56 123.19,20.19 | 125.09,15.24 125.09,16.76
  Bottom 0.61: D19.7 85.85,21.08 86.74,20.19 86.74,18.29 84.45,16 LED7.4 | D20.7 98.55,21.08 99.57,20.07 99.06,19.56 99.06,18.16 96.9,16 LED8.4 | D24.7 148.08,21.08 | 148.08,21.08 148.46,21.08 149.73,22.35 153.03,22.35 153.67,21.72 153.67,20.19 v153.54,20.07 | D23.7 135.89,21.08 136.4,20.57 | 136.4,20.57 136.4,18.41 133.99,16 LED11.4 | D27.7 185.67,21.08 186.18,20.57 186.18,18.16 184.02,16 LED15.4 | 111.51,17.65 111.51,19.81 D21.7 111.51,22.35 115.82,22.35 116.59,21.59 116.59,20.32 116.33,20.07 v116.2,20.07 | v29.08,20.07 29.34,21.46 28.57,22.35 26.67,22.35 D14.7 24.38,19.81 24.38,18.16 22.23,16 LED2.4 | D2.7 11.94,19.81 11.94,18.16 9.78,16 LED1.4 | v178.82,21.34 178.69,21.46 178.05,22.35 173.74,22.23 D26.7 173.86,19.68 173.86,18.29 171.58,16 LED14.4 | v165.99,20.07 166.24,21.34 165.61,22.35 161.29,22.35 D25.7 161.29,19.81 161.29,18.16 159.13,16 LED13.4 | v78.87,20.07 79.12,21.34 78.49,22.35 74.17,22.35 D18.7 74.17,19.81 74.17,18.16 72.01,16 LED6.4 | v66.42,20.07 66.67,21.21 66.04,22.35 64.01,22.35 D17.7 61.85,19.94 61.85,18.29 59.56,16 LED5.4 | v53.98,20.07 54.1,21.34 53.59,22.35 49.28,22.35 D16.7 49.28,19.81 49.28,18.16 47.12,16 LED4.4 | v41.53,20.07 41.78,21.34 41.15,22.35 36.83,22.35 D15.7 36.83,19.81 36.83,18.16 34.67,16 LED3.4 | 148.08,21.08 148.84,20.32 148.84,18.16 146.69,16 LED12.4 | LED9.4 109.6,16 | v128.65,20.07 128.91,21.34 128.27,22.35 123.44,22.35 122.94,21.84 122.94,21.34 D22.7 122.81,20.95 122.81,20.32 122.94,20.19 123.19,20.19 | 136.4,20.57 138.18,22.35 140.72,22.35 141.35,21.72 141.35,21.08 v141.1,20.07 | 123.95,18.03 122.3,16.26 121.41,16.26 LED10.4
  Bottom 0.61: 123.95,18.03 123.95,19.3 123.83,19.56 | JP8.1 123.32,13.21 125.09,14.99 125.09,15.24 | 125.09,16.76 125.09,17.02 123.95,18.03
SEG_C_SOURCE
  Bottom 0.406: M6.3 116.08,14.48 116.59,13.97 116.59,12.7 117.6,11.68 119.13,11.68 JP10.1
SEG_D  (via drill 0.51)
  Top 0.305: 11.43,20.07 10.03,19.94 | 36.32,20.07 34.92,19.94 | 23.88,20.07 22.48,19.94 | 98.55,20.07 97.16,19.94 | 86.11,20.07 84.71,19.94 | 111,20.07 109.6,19.94 | 135.89,20.07 134.49,19.94 | 123.44,20.07 122.05,19.94 | 61.21,20.07 59.82,19.94 | 48.77,20.07 47.37,19.94 | 73.66,20.07 72.26,19.94 | 173.23,20.07 171.83,19.94 | 160.78,20.07 159.38,19.94 | 148.34,20.07 146.94,19.94
  Top 0.406: 10.03,19.94 9.91,20.07 | 34.92,19.94 34.8,20.07 | 32.89,20.07 34.42,20.07 | 20.45,20.07 21.97,20.07 | 22.48,19.94 22.35,20.07 | 97.16,19.94 97.03,20.07 | 95.12,20.07 96.65,20.07 | 82.68,20.07 84.2,20.07 | 84.71,19.94 84.58,20.07 | 109.6,19.94 109.47,20.07 | 107.57,20.07 109.09,20.07 | 134.49,19.94 134.37,20.07 | 132.46,20.07 133.99,20.07 | 122.05,19.94 121.92,20.07 | 59.82,19.94 59.69,20.07 | 57.78,20.07 59.31,20.07 | 45.34,20.07 46.86,20.07 | 47.37,19.94 47.24,20.07 | 72.26,19.94 72.14,20.07 | 70.23,20.07 71.75,20.07 | 171.83,19.94 171.7,20.07 | 169.8,20.07 171.32,20.07 | 157.35,20.07 158.88,20.07 | 159.38,19.94 159.26,20.07 | 146.94,19.94 146.81,20.07 | 144.91,20.07 146.43,20.07 | 120.02,20.07 121.54,20.07
  Top 0.61: 9.91,20.07 9.65,20.07 9.4,20.32 4.45,20.32 D2.5 3.05,17.27 LED1.2 | 34.8,20.07 34.42,20.07 | 36.32,20.07 39.75,18.92 D16.5 | 32.89,20.07 31.5,20.07 30.1,18.67 28.19,18.67 D15.5 | 20.45,20.07 19.05,20.07 17.91,18.92 | 23.88,20.07 27.3,18.92 D15.5 | 22.35,20.07 21.97,20.07 | 97.03,20.07 96.65,20.07 | 95.12,20.07 93.73,20.07 92.58,18.92 D20.5 | 82.68,20.07 80.64,20.07 79.5,18.92 D19.5 | 86.11,20.07 89.53,18.92 D20.5 | 84.58,20.07 84.2,20.07 | 109.47,20.07 109.09,20.07 | 111,20.07 114.43,18.92 D22.5 | 107.57,20.07 106.43,20.07 105.16,18.92 D21.5 | 98.55,20.07 99.69,18.92 D21.5 | 134.37,20.07 133.99,20.07 | 132.46,20.07 131.06,20.07 129.92,18.92 D23.5 | 121.92,20.07 121.54,20.07 | 59.69,20.07 59.31,20.07 | 57.78,20.07 55.75,20.07 54.61,18.92 D17.5 | 45.34,20.07 43.18,20.07 41.91,18.8 40.51,18.8 D16.5 | 48.77,20.07 52.2,18.92 D17.5 | 47.24,20.07 46.86,20.07 | 72.14,20.07 71.75,20.07 | 73.66,20.07 77.09,18.92 D19.5 | 70.23,20.07 68.83,20.07 67.69,18.92 D18.5 | 61.21,20.07 64.64,18.92 D18.5 | 171.7,20.07 171.32,20.07 | 169.8,20.07 168.4,20.07 167.13,18.8 164.97,18.8 D26.5 | 157.35,20.07 155.83,20.07 153.54,17.78 | 160.78,20.07 164.21,18.92 D26.5 | 159.26,20.07 158.88,20.07 | 173.23,20.07 176.66,18.92 D27.5 | 146.81,20.07 146.43,20.07 | 148.34,20.07 151.76,18.92 D25.5 153.54,17.78 | 144.91,20.07 143.51,20.07 142.37,18.92 D24.5 | 135.89,20.07 139.32,18.92 D24.5 | 17.91,18.92 17.78,18.8 17.78,17.78 16.76,16.76 LED2.2 | 120.02,20.07 118.11,20.07 116.97,18.92 D22.5 | 11.43,20.07 12.57,18.92 D14.5 17.91,18.92 | LED12.2 141.22,17.65 D24.5 | LED10.2 116.33,17.4 115.06,18.67 D22.5 | LED9.2 103.89,16.89 102.62,18.16 D21.5
  Top 0.61: LED8.2 91.44,16.76 90.17,18.03 D20.5 | LED7.2 78.99,17.65 D19.5 | LED4.2 41.66,16.13 40.39,17.4 D16.5 | LED3.2 29.08,16 27.94,17.14 D15.5 | LED14.2 166.12,17.65 D26.5 | 153.54,17.78 153.67,17.65 LED13.2 153.67,15.11 v152.91,13.84 | 52.96,18.8 D17.5 | 65.41,18.8 D18.5 | 127.64,18.8 D23.5 | 123.44,20.07 126.36,20.07 D23.5
  Bottom 0.61: M7.3 152.02,13.84 v152.91,13.84 | D27.5 177.29,17.27 LED15.2 | LED5.2 52.83,17.27 D17.5 | LED6.2 66.42,16 65.28,17.14 D18.5 | LED11.2 128.78,17.65 D23.5
SEG_DP
  Top 0.406: 21.46,22.35 21.59,22.35 22.73,23.5 22.99,23.5 D14.8 | 33.91,22.35 34.04,22.35 35.18,23.5 35.43,23.5 D15.8 | 158.37,22.35 158.5,22.35 159.64,23.5 159.89,23.5 D25.8 | 170.81,22.35 170.94,22.35 172.09,23.5 172.34,23.5 D26.8 | 133.48,22.35 133.6,22.35 134.75,23.5 135,23.5 D23.8 | 108.58,22.35 108.71,22.35 109.86,23.5 110.11,23.5 D21.8 | 83.69,22.35 83.82,22.35 84.96,23.5 85.22,23.5 D19.8 | 96.14,22.35 96.27,22.35 97.41,23.5 97.66,23.5 D20.8 | 46.35,22.35 46.48,22.35 47.75,23.62 D16.8 | 58.8,22.35 58.93,22.35 60.07,23.5 60.33,23.5 D17.8 | 71.25,22.35 71.37,22.35 72.52,23.5 72.77,23.5 D18.8 | 145.92,22.35 146.05,22.35 147.19,23.5 147.45,23.5 D24.8 | 121.03,22.35 121.16,22.35 122.43,23.62 D22.8 | 185.04,23.5 D27.8 | LED9.5 110.74,16 109.35,14.86 108.2,14.86 107.82,15.24 107.82,17.27 108.2,17.65 108.58,17.65 110.11,18.92 D21.6
  Top 0.61: 22.86,23.62 D14.8 23.88,23.62 27.43,22.35 33.91,22.35 | D2.8 13.34,23.62 14.61,22.35 21.46,22.35 | 35.31,23.62 D15.8 36.32,23.62 39.88,22.35 46.35,22.35 | 185.04,23.5 183.9,22.35 176.78,22.35 173.23,23.62 D26.8 | 158.37,22.35 151.89,22.35 148.34,23.62 D24.8 | 170.81,22.35 164.34,22.35 160.78,23.62 D25.8 | 133.48,22.35 127,22.35 123.44,23.62 D22.8 | 108.58,22.35 101.85,22.35 100.58,23.62 D20.8 | 83.69,22.35 77.22,22.35 73.66,23.62 D18.8 | 96.14,22.35 89.66,22.35 86.11,23.62 D19.8 | 58.8,22.35 52.32,22.35 48.77,23.62 D16.8 | D17.8 61.21,23.62 64.77,22.35 71.25,22.35 | D21.8 111,23.62 114.55,22.35 121.03,22.35 | D23.8 135.89,23.62 139.45,22.35 145.92,22.35 | LED15.5 186.18,17.65 D27.6 | LED14.5 173.74,17.65 D26.6 | LED13.5 161.29,17.65 D25.6 | LED12.5 148.84,17.65 D24.6 | LED8.5 99.06,17.65 D20.6 | LED7.5 86.61,17.65 D19.6 | LED4.5 49.28,17.65 D16.6 | LED3.5 36.83,17.65 D15.6 | LED2.5 24.38,17.65 D14.6 | LED1.5 11.94,17.65 D2.6 | 60.4,18.87 60.4,17.32 LED5.5 | JP12.1 74.17,14.86 LED6.5 74.17,17.65 D18.6 | LED11.5 136.4,17.65 D23.6
  Top 0.813: 10.62,18.87 D2.6 | 23.06,18.87 D14.6 | 159.97,18.87 D25.6 | 122.63,18.87 D22.6 | 85.29,18.87 D19.6 | 47.96,18.87 D16.6 | 184.86,18.87 D27.6 | 72.85,18.87 D18.6 | 60.4,18.87 D17.6 | 35.51,18.87 D15.6 | 172.42,18.87 D26.6 | 147.52,18.87 D24.6 | 135.08,18.87 D23.6 | 110.19,18.87 D21.6 | 97.74,18.87 D20.6
  Bottom 0.406: 183.77,22.1 183.77,21.97 183.64,21.84 183.64,20.45 183.77,20.32
  Bottom 0.61: 10.67,23.37 9.4,22.1 9.4,20.32 10.41,19.3 | 184.91,23.37 183.77,22.1 | 183.77,20.32 184.66,19.3 | 172.47,23.37 171.2,22.1 171.2,20.32 172.21,19.3 | 160.02,23.37 158.75,22.1 158.75,20.32 159.77,19.3 | 147.57,23.37 146.3,22.1 146.3,20.32 147.32,19.3 | 135.13,23.37 133.86,22.1 133.86,20.32 134.87,19.3 | 122.68,23.37 121.41,22.1 121.41,20.32 122.43,19.3 | D21.8 108.97,22.35 108.97,20.32 109.98,19.3 | 97.79,23.37 96.52,22.1 96.52,20.32 97.54,19.3 | 85.34,23.37 84.07,22.1 84.07,20.32 85.09,19.3 | 72.9,23.37 71.63,22.1 71.63,20.32 72.64,19.3 | 60.45,23.37 59.18,22.1 59.18,20.32 60.2,19.3 | 48.01,23.37 46.74,22.1 46.74,20.32 47.75,19.3 | 35.56,23.37 34.29,22.1 34.29,20.32 35.31,19.3 | 23.11,23.37 21.84,22.1 21.84,20.32 22.86,19.3 | LED10.5 123.7,16 122.43,14.73 119.76,14.73 | 119.76,14.73 119.63,14.73 JP9.1 | D22.6 122.68,18.8 121.41,17.53 120.78,17.53 120.14,16.89 120.14,15.11 119.76,14.73
  Bottom 0.813: D2.8 10.67,23.37 | 10.41,19.3 10.41,19.18 D2.6 | D14.8 23.11,23.37 | D27.8 184.91,23.37 | 184.66,19.3 184.66,19.18 D27.6 | D26.8 172.47,23.37 | 172.21,19.3 172.21,19.18 D26.6 | D25.8 160.02,23.37 | 159.77,19.3 159.77,19.18 D25.6 | D24.8 147.57,23.37 | 147.32,19.3 147.32,19.18 D24.6 | D23.8 135.13,23.37 | 134.87,19.3 134.87,19.18 D23.6 | D22.8 122.68,23.37 | 122.43,19.3 122.43,19.18 D22.6 | 109.98,19.3 109.98,19.18 D21.6 | D20.8 97.79,23.37 | 97.54,19.3 97.54,19.18 D20.6 | D19.8 85.34,23.37 | 85.09,19.3 85.09,19.18 D19.6 | D18.8 72.9,23.37 | 72.64,19.3 72.64,19.18 D18.6 | D17.8 60.45,23.37 | 60.2,19.3 60.2,19.18 D17.6 | D16.8 48.01,23.37 | 47.75,19.3 47.75,19.18 D16.6 | D15.8 35.56,23.37 | 35.31,19.3 35.31,19.18 D15.6 | 22.86,19.3 22.86,19.18 D14.6
SEG_DP_SOURCE
  Bottom 0.406: 80.26,11.18 77.34,14.1 75.95,14.1 74.55,12.7 74.04,12.7 JP7.1
  Bottom 0.61: M11.3 88.9,9.53 88.52,9.14 83.82,9.14 83.06,9.91 82.68,9.91 81.92,10.67 80.77,10.67 80.26,11.18
SEG_E
  Top 0.406: 23.88,22.35 22.61,22.35 21.84,21.59 16,21.59 D14.4 | 12.83,22.35 9.91,22.35 | 73.66,22.35 72.39,22.35 71.63,21.59 65.79,21.59 D18.4 | 61.21,22.35 59.94,22.35 59.18,21.59 53.34,21.59 D17.4 | 48.77,22.35 47.5,22.35 46.74,21.59 40.89,21.59 D16.4 | 36.32,22.35 35.05,22.35 34.29,21.59 28.45,21.59 D15.4 | 86.11,22.35 84.84,22.35 84.07,21.59 78.23,21.59 D19.4 | 123.44,22.35 122.17,22.35 121.41,21.59 115.57,21.59 D22.4 | 173.23,22.35 171.96,22.35 171.2,21.59 165.35,21.59 D26.4 | 160.78,22.35 159.51,22.35 158.75,21.59 152.91,21.59 D25.4 | 135.89,22.35 134.62,22.35 133.86,21.59 128.02,21.59 D23.4 | D24.4 140.46,21.59 146.3,21.59 147.07,22.35 148.34,22.35 | 100.33,22.35 97.28,22.35 96.52,21.59 90.68,21.59 D20.4 | 111,22.35 109.73,22.35 108.97,21.59 103.12,21.59 D21.4
  Top 0.61: 23.88,22.35 27.43,21.08 D15.4 | 15.75,21.34 D14.4 14.1,21.08 12.83,22.35 | 3.3,21.34 D2.4 | 9.91,22.35 9.14,21.59 3.56,21.59 D2.4 | 48.77,22.35 52.32,21.08 D17.4 | 40.64,21.34 D16.4 39.88,21.08 36.32,22.35 | 61.21,22.35 64.77,21.08 D18.4 | 86.11,22.35 89.66,21.08 D20.4 | 77.98,21.34 D19.4 77.22,21.08 73.66,22.35 | 123.44,22.35 127,21.08 D23.4 | 115.32,21.34 D22.4 114.55,21.08 111,22.35 | 173.23,22.35 176.78,21.08 D27.4 178.69,19.68 178.69,18.29 176.15,16 LED15.1 | 160.78,22.35 164.34,21.08 D26.4 | 152.65,21.34 D25.4 151.89,21.08 148.34,22.35 | 135.89,22.35 139.45,21.08 D24.4 | D21.4 101.6,21.08 100.33,22.35 | LED12.1 138.81,16 | LED11.1 126.36,16 | LED2.1 14.35,16 | 1.91,16 LED1.1 1.78,19.94 2.92,21.08 D2.4
  Top 0.813: D2.4 3.3,21.08
  Bottom 0.406: D23.4 127.51,20.7 126.24,19.43
  Bottom 0.61: D14.4 15.11,21.08 14.1,20.07 14.1,16.13 LED2.1 | LED3.1 26.67,20.93 26.98,21.24 27.78,21.24 D15.4 | D26.4 163.58,19.81 LED14.1 | LED13.1 151.13,19.81 D25.4 | D16.4 39.12,19.81 LED4.1 36.32,13.21 M8.3 | LED5.1 51.56,19.81 D17.4 | LED6.1 64.01,19.81 D18.4 | LED7.1 76.45,19.81 D19.4 | LED8.1 88.9,19.81 D20.4 | LED9.1 101.35,19.81 D21.4 | LED10.1 113.79,19.81 D22.4 | LED12.1 138.68,19.81 D24.4 | 126.24,19.43 LED11.1
SEG_F  (via drill 0.51, 0.6)
  Top 0.406: 118.36,28.7 v118.36,27.43
  Top 0.61: v6.35,27.43 6.35,28.83 4.57,30.48 4.57,30.99 LED1.9 | v18.8,27.43 18.8,28.83 16.76,30.86 LED2.9 | 26.67,24.89 19.18,24.89 v19.05,24.77 18.92,24.89 16.76,24.89 16.51,25.15 | v31.24,27.43 31.24,28.7 29.21,30.73 LED3.9 | 36.83,24.89 31.62,24.89 v31.5,24.77 31.37,24.89 29.21,24.89 28.96,25.15 | v155.7,27.43 155.7,28.7 153.67,30.73 LED13.9 | 161.29,24.89 156.08,24.89 v155.96,24.77 155.83,24.89 153.67,24.89 153.42,25.15 | v168.15,27.43 168.15,28.7 166.12,30.73 LED14.9 | 176.02,24.89 168.53,24.89 v168.4,24.77 168.28,24.89 166.12,24.89 165.86,25.15 | 178.31,25.15 178.56,24.89 180.72,24.89 v180.85,24.77 180.97,24.89 | v43.69,27.43 43.69,28.7 41.66,30.73 LED4.9 | 49.28,24.89 44.07,24.89 v43.94,24.77 43.81,24.89 41.66,24.89 41.4,25.15 | v56.13,27.43 56.13,28.7 54.1,30.73 LED5.9 | 53.85,25.15 54.1,24.89 56.26,24.89 v56.39,24.77 56.52,24.89 64.01,24.89 | v68.58,27.43 68.58,28.7 66.55,30.73 LED6.9 | 74.17,24.89 68.96,24.89 v68.83,24.77 68.71,24.89 66.55,24.89 66.29,25.15 | v81.03,27.43 81.03,28.7 78.99,30.73 LED7.9 | 88.9,24.89 81.41,24.89 v81.28,24.77 81.15,24.89 78.99,24.89 78.74,25.15 | v180.59,27.43 180.59,28.7 178.56,30.73 LED15.9 | 118.36,28.7 116.33,30.73 LED10.9 | 123.95,24.89 118.75,24.89 v118.62,24.77 118.49,24.89 116.33,24.89 116.08,25.15 | v130.81,27.43 130.81,28.7 128.78,30.73 LED11.9 | 136.4,24.89 131.19,24.89 v131.06,24.77 130.94,24.89 128.78,24.89 128.52,25.15 | v143.26,27.43 143.26,28.7 141.22,30.73 LED12.9 | 148.84,24.89 143.64,24.89 v143.51,24.77 143.38,24.89 141.22,24.89 140.97,25.15 | v93.47,27.69 93.47,28.7 91.44,30.73 LED8.9 | 91.19,25.15 91.31,25.02 v93.34,25.02 93.47,24.89 99.19,24.89 100.33,26.04 102.49,26.04 D21.2
  Top 0.61: v105.92,27.43 105.92,28.7 103.89,30.73 LED9.9 | 103.63,25.15 103.89,24.89 106.05,24.89 v106.17,24.77 106.3,24.89 111.51,24.89 | v34.42,12.7 34.67,12.95 35.69,12.95 36.07,12.57 36.07,8.76 36.58,8.26 44.2,8.26 v44.96,9.02 | 9.65,24.89 14.22,24.89 D14.2 | v20.57,14.99 20.32,14.73 13.34,14.73 v13.08,14.99
  Top 0.813: 9.65,24.89 9.4,25.15 v6.6,25.15 4.06,25.15 D2.2 | 26.67,24.89 D15.2 28.96,25.15 | 16.51,25.15 D14.2 | 74.17,24.89 D19.2 78.74,25.15 | 49.28,24.89 D17.2 53.85,25.15 | 36.83,24.89 D16.2 41.4,25.15 | 64.01,24.89 D18.2 66.29,25.15 | 136.4,24.89 D24.2 140.97,25.15 | 176.02,24.89 D27.2 178.31,25.15 | 161.29,24.89 D26.2 165.86,25.15 | 88.9,24.89 D20.2 91.19,25.15 | 153.42,25.15 D25.2 148.84,24.89 | 128.52,25.15 D23.2 123.95,24.89 | 103.63,25.15 D21.2 | 111.51,24.89 D22.2 116.08,25.15
  Bottom 0.406: v13.08,14.99 13.08,16.76
  Bottom 0.61: v6.35,27.43 6.35,25.4 v6.6,25.15 | 18.8,25.15 v19.05,24.77 | v18.8,27.43 18.8,25.15 | 18.8,25.15 18.8,25.02 v19.05,24.77 | 31.24,25.15 v31.5,24.77 31.24,25.02 v31.24,27.43 | 43.69,25.15 v43.94,24.77 43.69,25.02 v43.69,27.43 | 81.03,25.15 v81.28,24.77 81.03,25.02 v81.03,27.43 | 68.58,25.15 v68.83,24.77 68.58,25.02 v68.58,27.43 | 56.13,25.15 v56.39,24.77 56.13,25.02 v56.13,27.43 | 105.92,25.15 v106.17,24.77 105.92,25.02 v105.92,27.43 | 118.36,25.15 v118.62,24.77 118.36,25.02 v118.36,27.43 | 130.81,25.15 v131.06,24.77 130.81,25.02 v130.81,27.43 | 143.26,25.15 v143.51,24.77 143.26,25.02 v143.26,27.43 | 155.7,25.15 v155.96,24.77 155.7,25.02 v155.7,27.43 | 168.15,25.15 v168.4,24.77 168.15,25.02 v168.15,27.43 | 180.59,25.15 v180.85,24.77 180.59,25.02 v180.59,27.43 | 18.92,24.64 v19.05,24.77 | M9.3 48.13,8.26 47.88,8.51 45.47,8.51 v44.96,9.02 | v93.47,27.69 93.47,27.56 93.34,27.43 v93.34,25.02 | v34.42,12.7 34.42,13.46 33.15,14.73 20.83,14.73 v20.57,14.99 | D14.2 13.08,23.75 13.08,16.76
SEG_G
  Top 0.305: 9.91,27.18 11.43,27.3 | 22.35,27.18 23.88,27.3 | 16.38,27.81 17.02,27.18 | 34.8,27.18 36.32,27.3 | 28.83,27.81 29.46,27.18 | 159.26,27.18 160.78,27.3 | 165.74,27.81 166.37,27.18 | 47.24,27.18 48.77,27.3 | 53.72,27.81 54.36,27.18 | 41.27,27.81 41.91,27.18 | 59.69,27.18 61.21,27.3 | 72.14,27.18 73.66,27.3 | 66.17,27.81 66.8,27.18 | 84.58,27.18 86.11,27.3 | 78.61,27.81 79.25,27.18 | 97.03,27.18 98.55,27.3 | 91.06,27.81 91.69,27.18 | 103.5,27.81 104.14,27.18 | 121.92,27.18 123.44,27.3 | 134.37,27.18 135.89,27.3 | 128.4,27.81 129.03,27.18 | 146.81,27.18 148.34,27.3 | 140.84,27.81 141.48,27.18 | 153.29,27.81 153.92,27.18 | 171.7,27.18 173.23,27.3 | 109.47,27.18 111,27.3 | 115.95,27.81 116.59,27.18
  Top 0.406: 20.07,27.18 19.3,26.42 17.78,26.42 17.02,27.18 | D14.1 15.88,28.32 16.38,27.81 | 32.51,27.18 31.75,26.42 30.23,26.42 29.46,27.18 | D15.1 28.32,28.32 28.83,27.81 | 156.97,27.18 156.21,26.42 154.69,26.42 153.92,27.18 | 169.42,27.18 168.66,26.42 167.13,26.42 166.37,27.18 | D26.1 165.23,28.32 165.74,27.81 | 44.96,27.18 44.2,26.42 42.67,26.42 41.91,27.18 | D16.1 40.77,28.32 41.27,27.81 | 57.4,27.18 56.64,26.42 55.12,26.42 54.36,27.18 | D17.1 53.21,28.32 53.72,27.81 | 69.85,27.18 69.09,26.42 67.56,26.42 66.8,27.18 | D18.1 65.66,28.32 66.17,27.81 | 82.3,27.18 81.53,26.42 80.01,26.42 79.25,27.18 | D19.1 78.11,28.32 78.61,27.81 | 94.74,27.18 94.23,26.67 92.2,26.67 91.69,27.18 | D20.1 90.55,28.32 91.06,27.81 | 107.19,27.18 106.43,26.42 104.9,26.42 104.14,27.18 | D21.1 103,28.32 103.5,27.81 | 119.63,27.18 118.87,26.42 117.35,26.42 116.59,27.18 | 132.08,27.18 131.32,26.42 129.79,26.42 129.03,27.18 | D23.1 127.89,28.32 128.4,27.81 | 144.53,27.18 143.76,26.42 142.24,26.42 141.48,27.18 | D24.1 140.34,28.32 140.84,27.81 | D25.1 152.78,28.32 153.29,27.81 | 177.67,28.32 D27.1 | D22.1 115.44,28.32 115.95,27.81
  Top 0.61: 9.91,27.18 7.75,27.18 6.86,26.29 4.83,26.29 3.05,28.07 D2.1 3.05,29.97 LED1.10 | 22.35,27.18 20.07,27.18 | 23.88,27.3 27.18,28.32 D15.1 27.94,29.97 LED3.10 | 34.8,27.18 32.51,27.18 | 159.26,27.18 156.97,27.18 | 160.78,27.3 164.08,28.32 D26.1 163.58,29.59 LED14.10 | 171.7,27.18 169.42,27.18 | 36.32,27.3 39.62,28.32 D16.1 39.12,29.59 LED4.10 | 47.24,27.18 44.96,27.18 | 48.77,27.3 52.07,28.32 D17.1 51.56,29.59 LED5.10 | 59.69,27.18 57.4,27.18 | 61.21,27.3 64.52,28.32 65.15,28.32 | 65.15,28.32 D18.1 | 72.14,27.18 69.85,27.18 | 73.66,27.3 76.96,28.32 D19.1 77.72,29.97 LED7.10 | 84.58,27.18 82.3,27.18 | 86.11,27.3 89.41,28.32 D20.1 90.17,29.97 LED8.10 | 97.03,27.18 94.74,27.18 | 98.55,27.3 99.57,28.32 100.46,28.32 | 121.92,27.18 119.63,27.18 | 123.44,27.3 126.75,28.32 D23.1 126.24,29.59 LED11.10 | 134.37,27.18 132.08,27.18 | 135.89,27.3 139.19,28.32 D24.1 138.68,29.59 LED12.10 | 146.81,27.18 144.53,27.18 | 176.78,28.32 176.53,28.32 173.23,27.3 | 176.78,28.32 D27.1 | 109.47,27.18 107.19,27.18 | 111,27.3 114.3,28.32 D22.1 113.79,29.59 LED10.10 | 148.34,27.3 151.64,28.32 D25.1 151.13,29.59 LED13.10 | 11.43,27.3 12.45,28.32 D14.1 15.49,29.97 LED2.10 | 65.15,28.32 65.28,28.45 65.28,29.97 LED6.10 | LED9.10 101.35,29.59 D21.1 | LED15.10 176.02,29.08 176.78,28.32
  Top 0.813: D14.1 15.11,28.32 | 40.51,28.07 40.39,28.07 D16.1 40.01,28.32 | 28.07,28.07 27.94,28.07 D15.1 27.56,28.32 | 177.42,28.07 177.29,28.07 D27.1 176.91,28.32 | 164.97,28.07 164.85,28.07 D26.1 164.47,28.32 | 52.96,28.07 52.83,28.07 D17.1 52.45,28.32 | 65.41,28.07 65.28,28.07 D18.1 64.9,28.32 | 90.3,28.07 90.17,28.07 D20.1 89.79,28.32 | 77.85,28.07 77.72,28.07 D19.1 77.34,28.32 | D21.1 100.46,28.32 99.95,28.32 | 140.08,28.07 139.95,28.07 D24.1 139.57,28.32 | 127.64,28.07 127.51,28.07 D23.1 127.13,28.32 | 152.53,28.07 152.4,28.07 D25.1 152.02,28.32 | 115.19,28.07 115.06,28.07 D22.1 114.68,28.32
  Bottom 0.406: 87.76,15.24 87.76,16.76
  Bottom 0.61: D2.3 3.05,24.26 4.32,25.53 4.32,26.8 D2.1 | D14.3 15.49,24.38 16.76,25.65 16.76,27.05 D14.1 | D16.3 40.39,24.38 41.66,25.65 41.66,27.05 D16.1 | D17.3 52.83,24.38 54.1,25.65 54.1,27.05 D17.1 | D18.3 65.28,24.38 66.55,25.65 66.55,27.05 D18.1 | D19.3 77.72,24.38 78.99,25.65 78.99,27.05 D19.1 | D20.1 91.44,27.05 91.44,25.65 90.17,24.38 D20.3 87.76,21.21 87.76,16.76 | D21.1 103.89,27.05 103.89,24.89 D21.3 | D22.3 115.06,24.38 116.33,25.65 116.33,27.05 D22.1 | D23.3 127.51,24.38 128.78,25.65 128.78,26.8 D23.1 | D24.3 139.95,24.38 141.22,25.65 141.22,27.05 D24.1 | D25.3 152.4,24.38 153.67,25.65 153.67,27.05 D25.1 | D26.3 164.85,24.38 166.12,25.65 166.12,27.05 D26.1 | D27.3 177.29,24.38 178.56,25.65 178.56,27.05 D27.1 | D15.1 29.21,27.05 29.21,25.65 27.94,24.38 D15.3 | 83.29,11.33 M10.3 84.07,10.41 85.72,10.41 87.5,12.19 87.5,14.73 87.76,14.99 87.76,15.24

## Text on the board
bPlace: /profiles/Jens_G | /profiles/Jens_G | https:/ /oshpark.com | CERN OHL v.1.2 | source | open